# EAGLE design Motherboard Rev C (EAGLE 9.2.1)
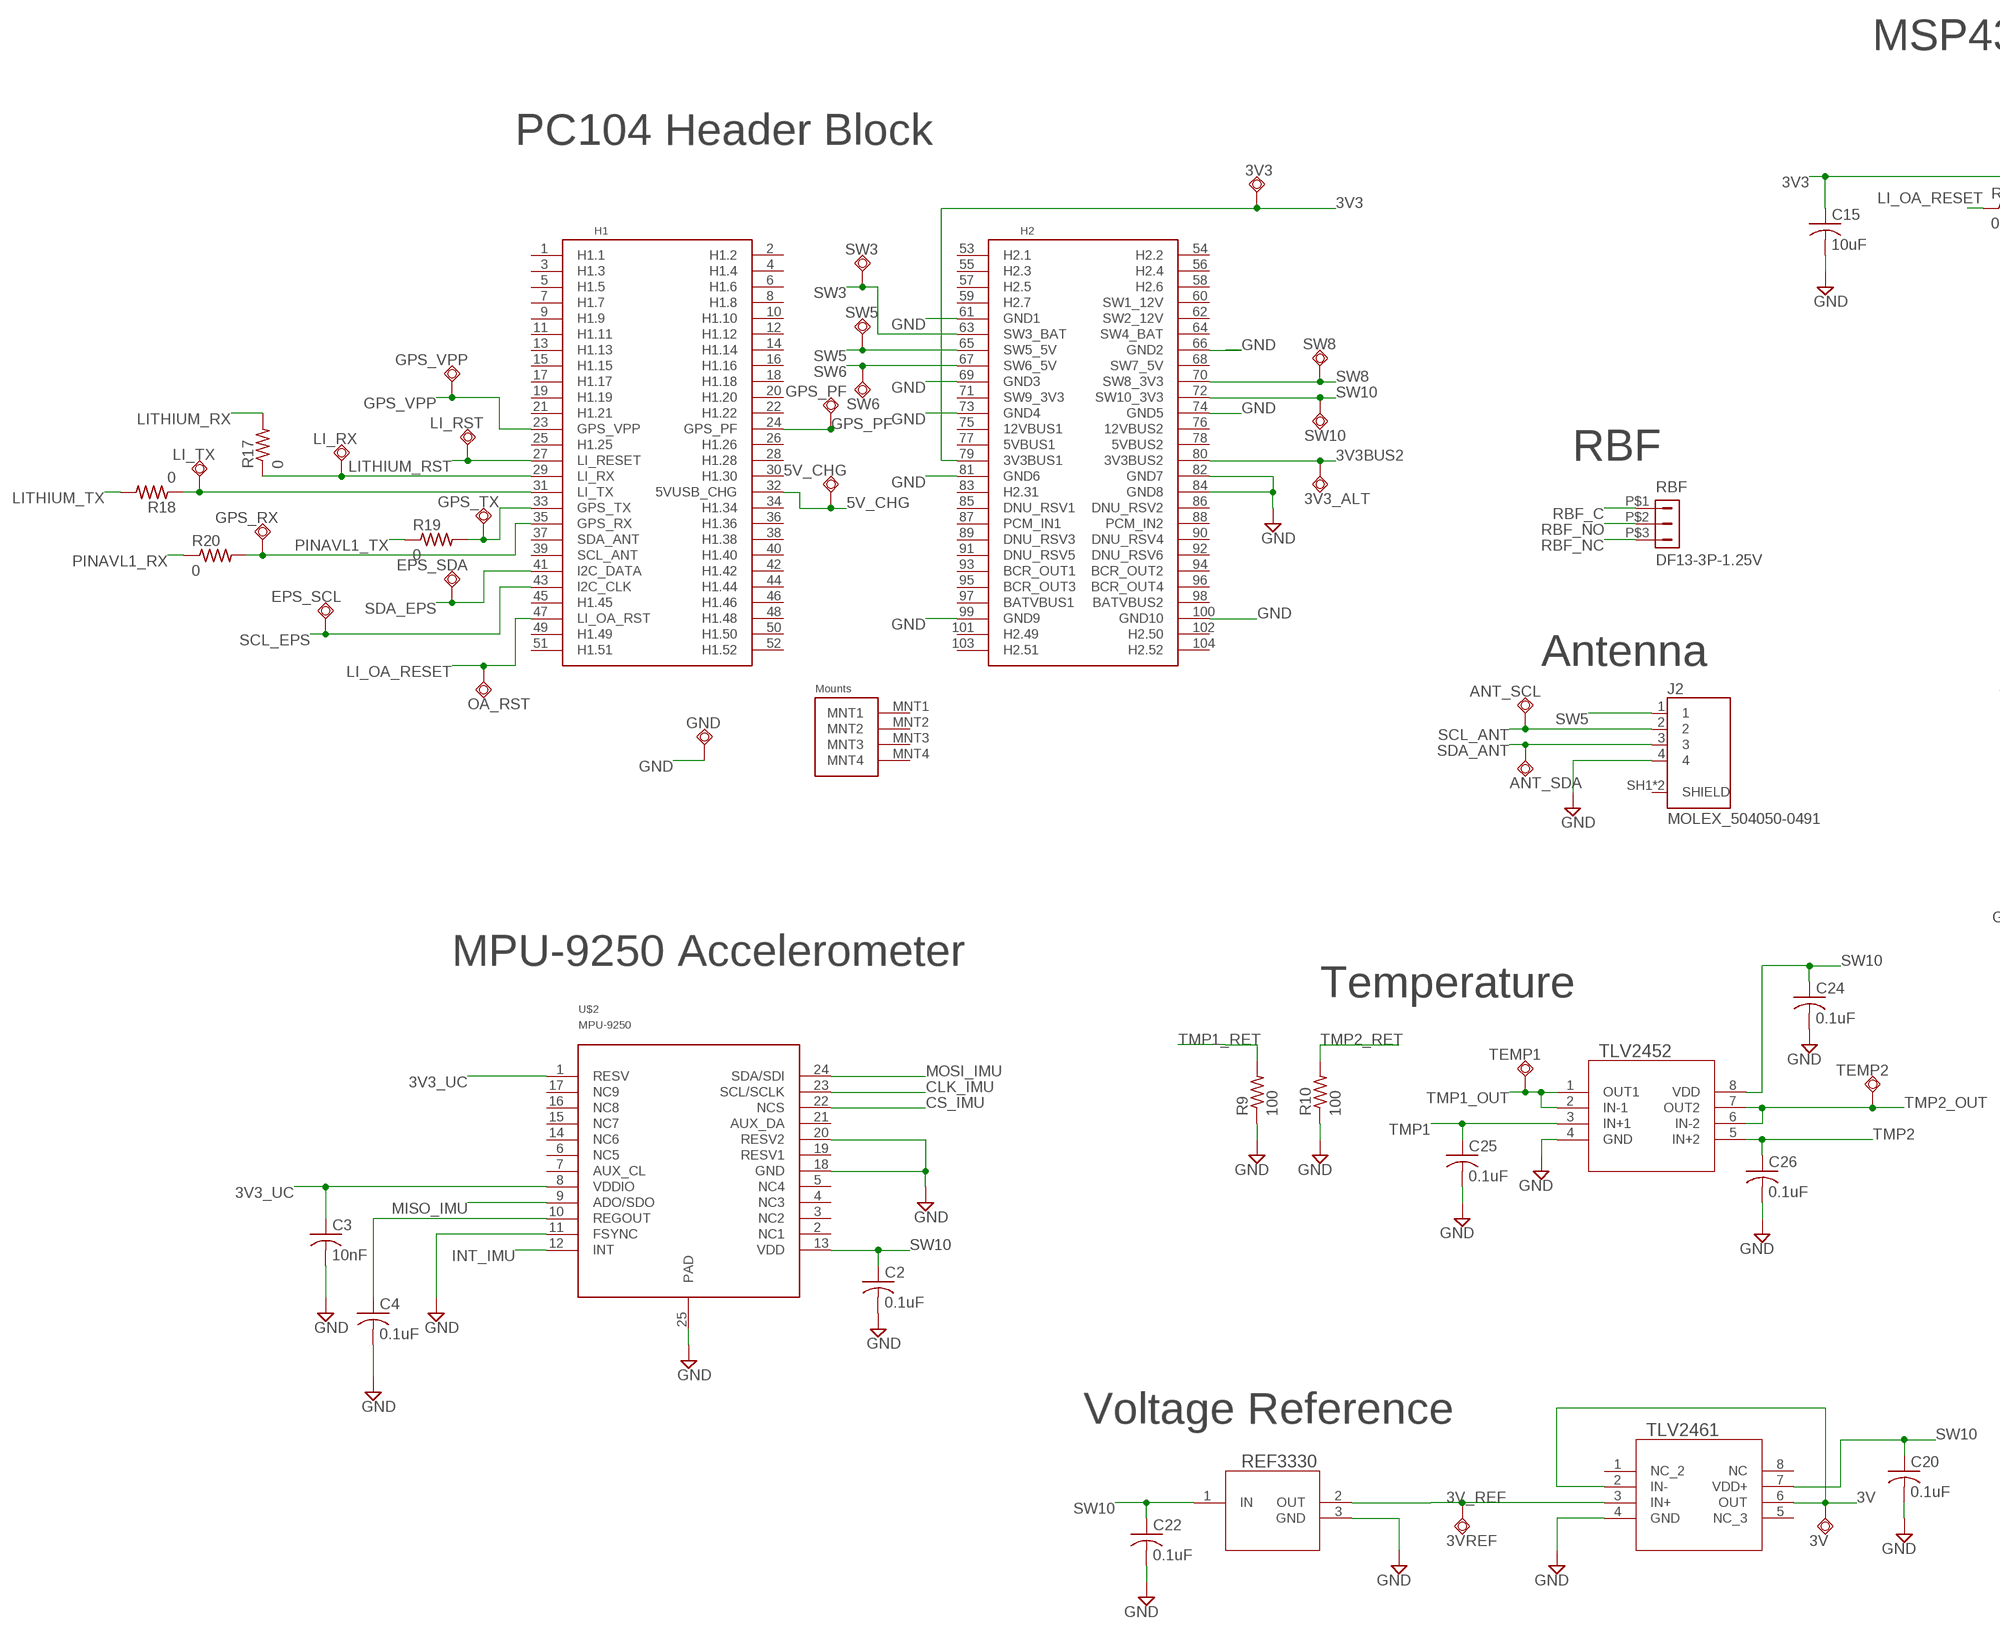
[diagram p0: schematic, sheet 1, part 1 of 2]
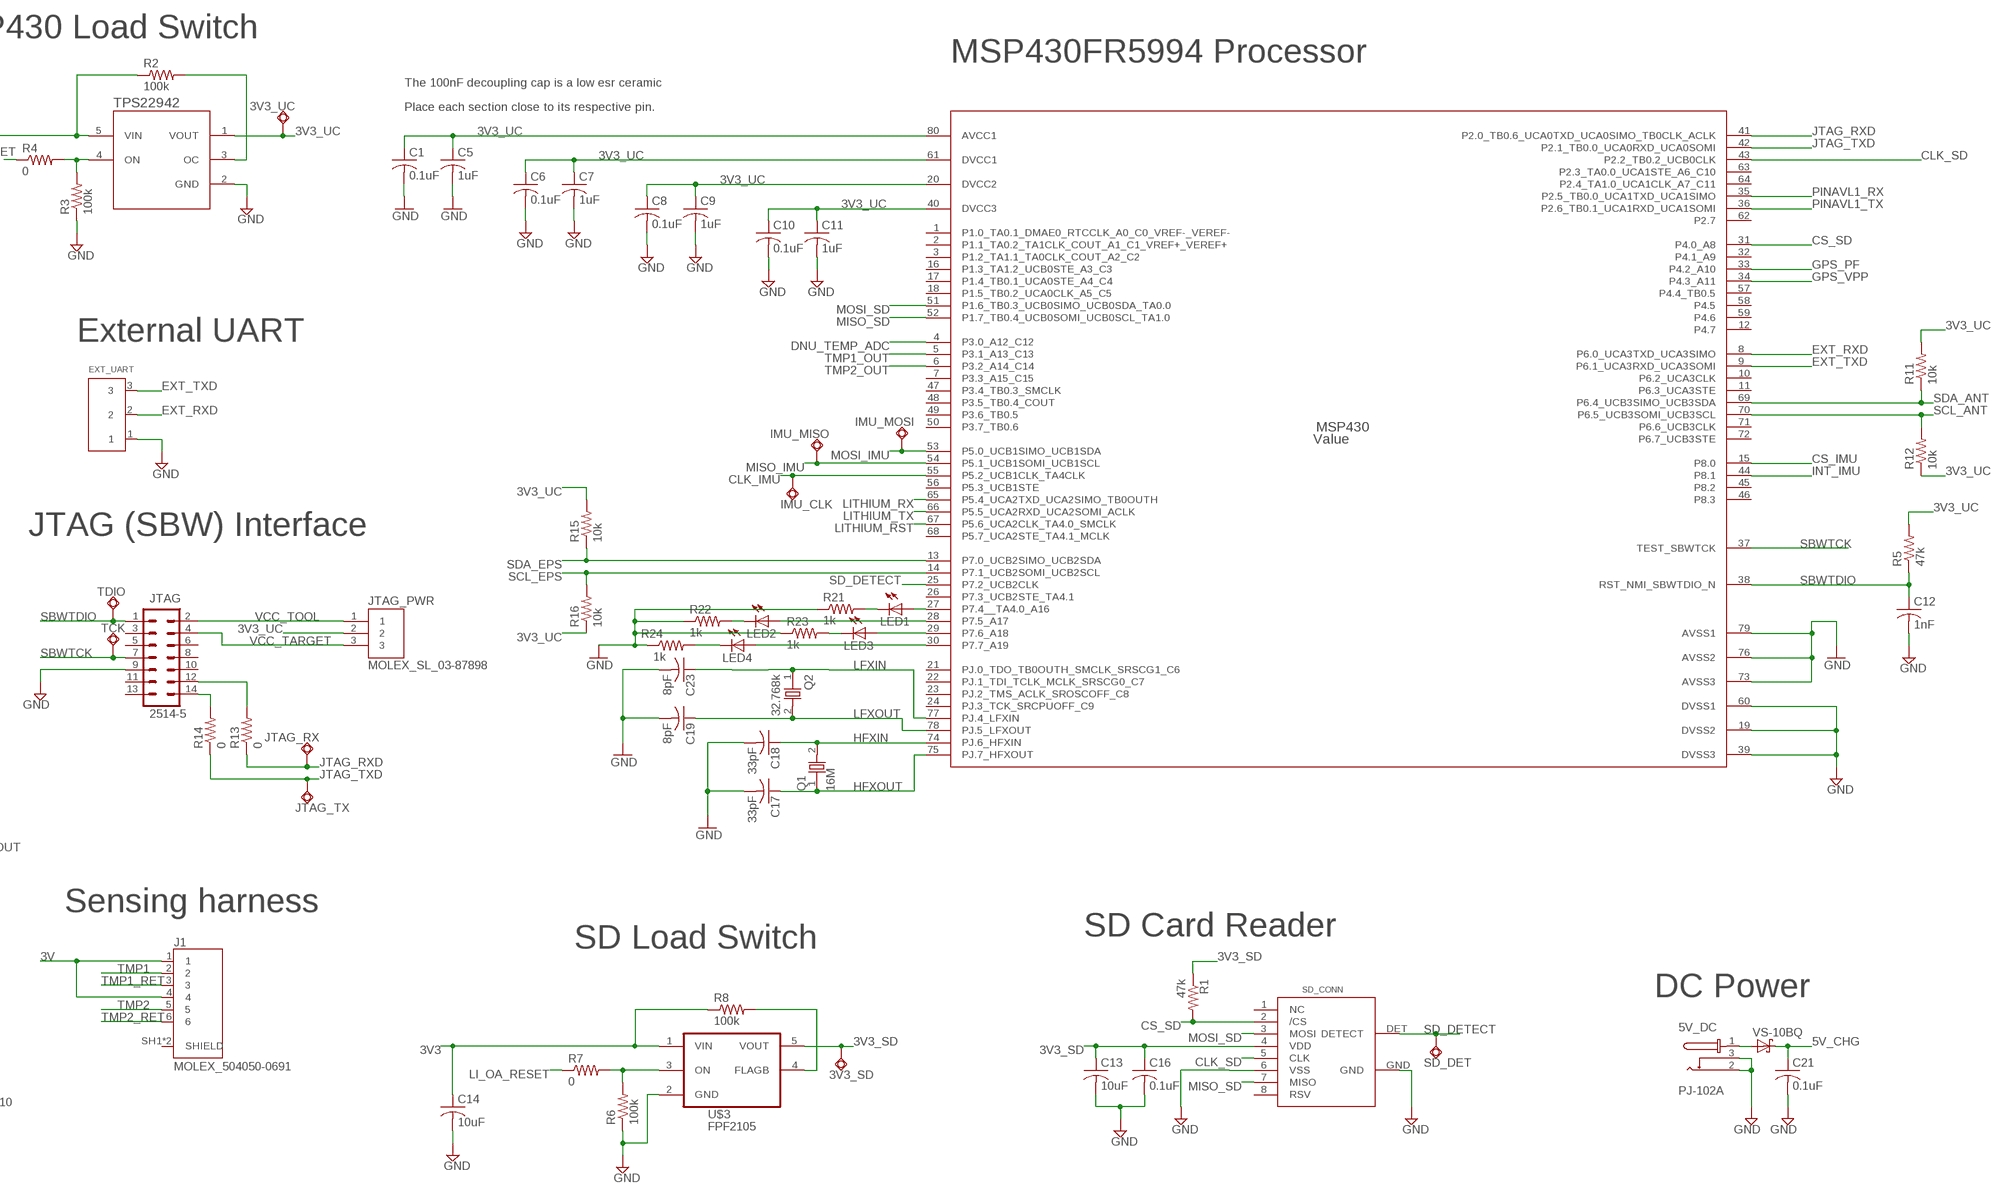
[diagram p1: schematic, sheet 1, part 2 of 2]

## Parts
3V  TPSQTP10SQ  [TP10SQ]
3V3  TPSQTP10SQ  [TP10SQ]
3V3_ALT  TPSQTP10SQ  [TP10SQ]
3V3_SD  TPSQTP10SQ  [TP10SQ]
3V3_UC  TPSQTP10SQ  [TP10SQ]
3VREF  TPSQTP10SQ  [TP10SQ]
5V_CHG  TPSQTP10SQ  [TP10SQ]
5V_DC  PJ-102A  [CUI_PJ-102A]
ANT_SCL  TPSQTP10SQ  [TP10SQ]
ANT_SDA  TPSQTP10SQ  [TP10SQ]
C1  0.1uF  C-USC0805  [C0805]
C2  0.1uF  C-USC0805  [C0805]
C3  10nF  C-USC0805  [C0805]
C4  0.1uF  C-USC0805  [C0805]
C5  1uF  C-USC0805  [C0805]
C6  0.1uF  C-USC0805  [C0805]
C7  1uF  C-USC0805  [C0805]
C8  0.1uF  C-USC0805  [C0805]
C9  1uF  C-USC0805  [C0805]
C10  0.1uF  C-USC0805  [C0805]
C11  1uF  C-USC0805  [C0805]
C12  1nF  C-USC0805  [C0805]
C13  10uF  C-USC0805  [C0805]
C14  10uF  C-USC0805  [C0805]
C15  10uF  C-USC0805  [C0805]
C16  0.1uF  C-USC0805  [C0805]
C17  33pF  C-USC0805  [C0805]
C18  33pF  C-USC0805  [C0805]
C19  8pF  C-USC0805  [C0805]
C20  0.1uF  C-USC0805  [C0805]
C21  0.1uF  C-USC0805  [C0805]
C22  0.1uF  C-USC0805  [C0805]
C23  8pF  C-USC0805  [C0805]
C24  0.1uF  C-USC0805  [C0805]
C25  0.1uF  C-USC0805  [C0805]
C26  0.1uF  C-USC0805  [C0805]
EPS_SCL  TPSQTP10SQ  [TP10SQ]
EPS_SDA  TPSQTP10SQ  [TP10SQ]
EXT_UART  90121-0763  [90121-0763]
GND  TPSQTP10SQ  [TP10SQ]
GPS_PF  TPSQTP10SQ  [TP10SQ]
GPS_RX  TPSQTP10SQ  [TP10SQ]
GPS_TX  TPSQTP10SQ  [TP10SQ]
GPS_VPP  TPSQTP10SQ  [TP10SQ]
IMU_CLK  TPSQTP06SQ  [TP06SQ]
IMU_MISO  TPSQTP06SQ  [TP06SQ]
IMU_MOSI  TPSQTP06SQ  [TP06SQ]
J1  MOLEX_504050-0691  [MOLEX_5040500691]
J2  MOLEX_504050-0491  [MOLEX_5040500491]
JTAG  2514-5  [PAK100/2500-5-14]
JTAG_PWR  MOLEX_SL_03-87898  [SL_87898_3]
JTAG_RX  TPSQTP10SQ  [TP10SQ]
JTAG_TX  TPSQTP10SQ  [TP10SQ]
LED1  LEDSML0805  [SML0805]
LED2  LEDSML0805  [SML0805]
LED3  LEDSML0805  [SML0805]
LED4  LEDSML0805  [SML0805]
LI_RST  TPSQTP10SQ  [TP10SQ]
LI_RX  TPSQTP10SQ  [TP10SQ]
LI_TX  TPSQTP10SQ  [TP10SQ]
MSP430  Value  MSP430FR5994IPNR  [PN0080A_N]
OA_RST  TPSQTP10SQ  [TP10SQ]
Q1  16M  FOX-C5BQ  [5X3.2]
Q2  32.768k  MS1V-T1K  [MS1V-T1K]
R1  47k  R-US_R0805  [R0805]
R2  100k  R-US_R0805  [R0805]
R3  100k  R-US_R0805  [R0805]
R4  0  R-US_R0805  [R0805]
R5  47k  R-US_R0805  [R0805]
R6  100k  R-US_R0805  [R0805]
R7  0  R-US_R0805  [R0805]
R8  100k  R-US_R0805  [R0805]
R9  100  R-US_R0805  [R0805]
R10  100  R-US_R0805  [R0805]
R11  10k  R-US_R0805  [R0805]
R12  10k  R-US_R0805  [R0805]
R13  0  R-US_R0805  [R0805]
R14  0  R-US_R0805  [R0805]
R15  10k  R-US_R0805  [R0805]
R16  10k  R-US_R0805  [R0805]
R17  0  R-US_R0805  [R0805]
R18  0  R-US_R0805  [R0805]
R19  0  R-US_R0805  [R0805]
R20  0  R-US_R0805  [R0805]
R21  1k  R-US_R0805  [R0805]
R22  1k  R-US_R0805  [R0805]
R23  1k  R-US_R0805  [R0805]
R24  1k  R-US_R0805  [R0805]
RBF  DF13-3P-1.25V  [DF13C-3P-1.25V]
REF3330  REF3330_DBZ_3  [DBZ3]
SD_CONN  502702-0891  [502702]
SD_DET  TPSQTP10SQ  [TP10SQ]
SW3  TPSQTP10SQ  [TP10SQ]
SW5  TPSQTP10SQ  [TP10SQ]
SW6  TPSQTP10SQ  [TP10SQ]
SW8  TPSQTP10SQ  [TP10SQ]
SW10  TPSQTP10SQ  [TP10SQ]
TCK  TPSQTP10SQ  [TP10SQ]
TDIO  TPSQTP10SQ  [TP10SQ]
TEMP1  TPSQTP10SQ  [TP10SQ]
TEMP2  TPSQTP10SQ  [TP10SQ]
TLV2452  TLV2452  [D8]
TLV2461  TLV2461A_D_8  [D8]
TPS22942  TPS22942DCKR  [DCK0005A]
U$1  PC104_NO_DIMENSION  [PC104_NO_DIMENSION]
U$2  MPU-9250  [LEAD-QFN24]
U$3  FPF2105  [SOT23-5]
VS-10BQ  10BQ015HM3  [SMB]

## Nets
3V: 3V.TP J1.1 J1.4 TLV2461.2(IN-) TLV2461.6(OUT)
3V3: 3V3.TP C14.1 C15.1 R2.1 R8.1 TPS22942.5(VIN) U$1.79(3V3BUS1) U$3.1(VIN)
3V3_SD: 3V3_SD.TP C13.1 C16.1 R1.1 SD_CONN.4(VDD) U$3.5(VOUT)
3V3_UC: 3V3_UC.TP C1.1 C3.1 C5.1 C6.1 C7.1 C8.1 C9.1 C10.1 C11.1 JTAG_PWR.2 MSP430.20(DVCC2) MSP430.40(DVCC3) MSP430.61(DVCC1) MSP430.80(AVCC1) R5.2 R11.2 R12.1 R15.2 R16.1 TPS22942.1(VOUT) U$2.1(RESV) U$2.8(VDDIO)
3V3BUS2: 3V3_ALT.TP U$1.80(3V3BUS2)
3V_REF: 3VREF.TP REF3330.2(OUT) TLV2461.3(IN+)
5V_CHG: 5V_CHG.TP C21.1 U$1.32(5VUSB_CHG) VS-10BQ.C
CLK_IMU: IMU_CLK.TP MSP430.55(P5.2_UCB1CLK_TA4CLK) U$2.23(SCL/SCLK)
CLK_SD: MSP430.43(P2.2_TB0.2_UCB0CLK) SD_CONN.5(CLK)
CS_IMU: MSP430.15(P8.0) U$2.22(NCS)
CS_SD: MSP430.31(P4.0_A8) R1.2 SD_CONN.2(/CS)
DNU_TEMP_ADC: MSP430.4(P3.0_A12_C12)
EXT_RXD: EXT_UART.2 MSP430.8(P6.0_UCA3TXD_UCA3SIMO)
EXT_TXD: EXT_UART.3 MSP430.9(P6.1_UCA3RXD_UCA3SOMI)
GND: 5V_DC.2 5V_DC.3 C1.2 C2.2 C3.2 C4.2 C5.2 C6.2 C7.2 C8.2 C9.2 C10.2 C11.2 C12.2 C13.2 C14.2 C15.2 C16.2 C17.2 C18.2 C19.2 C20.2 C21.2 C22.2 C23.2 C24.2 C25.2 C26.2 EXT_UART.1 GND.TP J2.4 JTAG.9 MSP430.19(DVSS2) MSP430.39(DVSS3) MSP430.60(DVSS1) MSP430.73(AVSS3) MSP430.76(AVSS2) MSP430.79(AVSS1) R3.1 R6.1 R9.1 R10.1 R21.1 R22.1 R23.1 R24.1 REF3330.3(GND) SD_CONN.6(VSS) SD_CONN.GND TLV2452.4(GND) TLV2461.4(GND) TPS22942.2(GND) U$1.61(GND1) U$1.66(GND2) U$1.69(GND3) U$1.73(GND4) U$1.74(GND5) U$1.81(GND6) U$1.82(GND7) U$1.84(GND8) U$1.99(GND9) U$1.100(GND10) U$2.11(FSYNC) U$2.18(GND) U$2.20(RESV2) U$2.25(PAD) U$3.2(GND)
GPS_PF: GPS_PF.TP MSP430.33(P4.2_A10) U$1.24(GPS_PF)
GPS_VPP: GPS_VPP.TP MSP430.34(P4.3_A11) U$1.23(GPS_VPP)
HFXIN: C18.1 MSP430.74(PJ.6_HFXIN) Q1.2
HFXOUT: C17.1 MSP430.75(PJ.7_HFXOUT) Q1.1
INT_IMU: MSP430.44(P8.1) U$2.12(INT)
JTAG_RXD: JTAG_RX.TP MSP430.41(P2.0_TB0.6_UCA0TXD_UCA0SIMO_TB0CLK_ACLK) R13.1
JTAG_TXD: JTAG_TX.TP MSP430.42(P2.1_TB0.0_UCA0RXD_UCA0SOMI) R14.1
LFXIN: C23.1 MSP430.77(PJ.4_LFXIN) Q2.1
LFXOUT: C19.1 MSP430.78(PJ.5_LFXOUT) Q2.2
LI_OA_RESET: OA_RST.TP R4.1 R7.1 U$1.47(LI_OA_RST)
LITHIUM_RST: LI_RST.TP MSP430.67(P5.6_UCA2CLK_TA4.0_SMCLK) U$1.27(LI_RESET)
LITHIUM_RX: MSP430.65(P5.4_UCA2TXD_UCA2SIMO_TB0OUTH) R17.2
LITHIUM_TX: MSP430.66(P5.5_UCA2RXD_UCA2SOMI_ACLK) R18.2
MISO_IMU: IMU_MISO.TP MSP430.54(P5.1_UCB1SOMI_UCB1SCL) U$2.9(ADO/SDO)
MISO_SD: MSP430.52(P1.7_TB0.4_UCB0SOMI_UCB0SCL_TA1.0) SD_CONN.7(MISO)
MOSI_IMU: IMU_MOSI.TP MSP430.53(P5.0_UCB1SIMO_UCB1SDA) U$2.24(SDA/SDI)
MOSI_SD: MSP430.51(P1.6_TB0.3_UCB0SIMO_UCB0SDA_TA0.0) SD_CONN.3(MOSI)
N$1: R2.2 TPS22942.3(OC)
N$2: R6.2 R7.2 U$3.3(ON)
N$3: C4.1 U$2.10(REGOUT)
N$4: LED1.C R21.2
N$5: R3.2 R4.2 TPS22942.4(ON)
N$6: LED1.A MSP430.27(P7.4__TA4.0_A16)
N$7: R8.2 U$3.4(FLAGB)
N$8: JTAG.14 R14.2
N$9: LED2.A MSP430.28(P7.5_A17)
N$10: LED2.C R22.2
N$11: JTAG.12 R13.2
N$12: LED3.A MSP430.29(P7.6_A18)
N$14: 5V_DC.1 VS-10BQ.A
N$15: LED3.C R23.2
N$16: LED4.A MSP430.30(P7.7_A19)
N$17: LED4.C R24.2
N$96: GPS_RX.TP R20.2 U$1.35(GPS_RX)
N$97: GPS_TX.TP R19.2 U$1.33(GPS_TX)
N$98: LI_TX.TP R18.1 U$1.31(LI_TX)
N$99: LI_RX.TP R17.1 U$1.29(LI_RX)
PINAVL1_RX: MSP430.35(P2.5_TB0.0_UCA1TXD_UCA1SIMO) R20.1
PINAVL1_TX: MSP430.36(P2.6_TB0.1_UCA1RXD_UCA1SOMI) R19.1
RBF_C: RBF.P$1
RBF_NC: RBF.P$3
RBF_NO: RBF.P$2
SBWTCK: JTAG.7 MSP430.37(TEST_SBWTCK) TCK.TP
SBWTDIO: C12.1 JTAG.1 MSP430.38(RST_NMI_SBWTDIO_N) R5.1 TDIO.TP
SCL_ANT: ANT_SCL.TP J2.2 MSP430.70(P6.5_UCB3SOMI_UCB3SCL) R12.2
SCL_EPS: EPS_SCL.TP MSP430.14(P7.1_UCB2SOMI_UCB2SCL) R16.2 U$1.43(I2C_CLK)
SD_DETECT: MSP430.25(P7.2_UCB2CLK) SD_CONN.DET(DETECT) SD_DET.TP
SDA_ANT: ANT_SDA.TP J2.3 MSP430.69(P6.4_UCB3SIMO_UCB3SDA) R11.1
SDA_EPS: EPS_SDA.TP MSP430.13(P7.0_UCB2SIMO_UCB2SDA) R15.1 U$1.41(I2C_DATA)
SW3: SW3.TP U$1.63(SW3_BAT)
SW5: J2.1 SW5.TP U$1.65(SW5_5V)
SW6: SW6.TP U$1.67(SW6_5V)
SW8: SW8.TP U$1.70(SW8_3V3)
SW10: C2.1 C20.1 C22.1 C24.1 REF3330.1(IN) SW10.TP TLV2452.8(VDD) TLV2461.7(VDD+) U$1.72(SW10_3V3) U$2.13(VDD)
TMP1: C25.1 J1.2 TLV2452.3(IN+1)
TMP1_OUT: MSP430.5(P3.1_A13_C13) TEMP1.TP TLV2452.1(OUT1) TLV2452.2(IN-1)
TMP1_RET: J1.3 R9.2
TMP2: C26.1 J1.5 TLV2452.5(IN+2)
TMP2_OUT: MSP430.6(P3.2_A14_C14) TEMP2.TP TLV2452.6(IN-2) TLV2452.7(OUT2)
TMP2_RET: J1.6 R10.2
VCC_TARGET: JTAG.4 JTAG_PWR.3
VCC_TOOL: JTAG.2 JTAG_PWR.1
Unconnected: JTAG.3 JTAG.5 JTAG.6 JTAG.8 JTAG.10 JTAG.11 JTAG.13 MSP430.1(P1.0_TA0.1_DMAE0_RTCCLK_A0_C0_VREF-_VEREF-) MSP430.2(P1.1_TA0.2_TA1CLK_COUT_A1_C1_VREF+_VEREF+) MSP430.3(P1.2_TA1.1_TA0CLK_COUT_A2_C2) MSP430.7(P3.3_A15_C15) MSP430.10(P6.2_UCA3CLK) MSP430.11(P6.3_UCA3STE) MSP430.12(P4.7) MSP430.16(P1.3_TA1.2_UCB0STE_A3_C3) MSP430.17(P1.4_TB0.1_UCA0STE_A4_C4) MSP430.18(P1.5_TB0.2_UCA0CLK_A5_C5) MSP430.21(PJ.0_TDO_TB0OUTH_SMCLK_SRSCG1_C6) MSP430.22(PJ.1_TDI_TCLK_MCLK_SRSCG0_C7) MSP430.23(PJ.2_TMS_ACLK_SROSCOFF_C8) MSP430.24(PJ.3_TCK_SRCPUOFF_C9) MSP430.26(P7.3_UCB2STE_TA4.1) MSP430.32(P4.1_A9) MSP430.45(P8.2) MSP430.46(P8.3) MSP430.47(P3.4_TB0.3_SMCLK) MSP430.48(P3.5_TB0.4_COUT) MSP430.49(P3.6_TB0.5) MSP430.50(P3.7_TB0.6) MSP430.56(P5.3_UCB1STE) MSP430.57(P4.4_TB0.5) MSP430.58(P4.5) MSP430.59(P4.6) MSP430.62(P2.7) MSP430.63(P2.3_TA0.0_UCA1STE_A6_C10) MSP430.64(P2.4_TA1.0_UCA1CLK_A7_C11) MSP430.68(P5.7_UCA2STE_TA4.1_MCLK) MSP430.71(P6.6_UCB3CLK) MSP430.72(P6.7_UCB3STE) SD_CONN.1(NC) SD_CONN.8(RSV) TLV2461.1(NC_2) TLV2461.5(NC_3) TLV2461.8(NC) U$1.1(H1.1) U$1.2(H1.2) U$1.3(H1.3) U$1.4(H1.4) U$1.5(H1.5) U$1.6(H1.6) U$1.7(H1.7) U$1.8(H1.8) U$1.9(H1.9) U$1.10(H1.10) U$1.11(H1.11) U$1.12(H1.12) U$1.13(H1.13) U$1.14(H1.14) U$1.15(H1.15) U$1.16(H1.16) U$1.17(H1.17) U$1.18(H1.18) U$1.19(H1.19) U$1.20(H1.20) U$1.21(H1.21) U$1.22(H1.22) U$1.25(H1.25) U$1.26(H1.26) U$1.28(H1.28) U$1.30(H1.30) U$1.34(H1.34) U$1.36(H1.36) U$1.37(SDA_ANT) U$1.38(H1.38) U$1.39(SCL_ANT) U$1.40(H1.40) U$1.42(H1.42) U$1.44(H1.44) U$1.45(H1.45) U$1.46(H1.46) U$1.48(H1.48) U$1.49(H1.49) U$1.50(H1.50) U$1.51(H1.51) U$1.52(H1.52) U$1.53(H2.1) U$1.54(H2.2) U$1.55(H2.3) U$1.56(H2.4) U$1.57(H2.5) U$1.58(H2.6) U$1.59(H2.7) U$1.60(SW1_12V) U$1.62(SW2_12V) U$1.64(SW4_BAT) U$1.68(SW7_5V) U$1.71(SW9_3V3) U$1.75(12VBUS1) U$1.76(12VBUS2) U$1.77(5VBUS1) U$1.78(5VBUS2) U$1.83(H2.31) U$1.85(DNU_RSV1) U$1.86(DNU_RSV2) U$1.87(PCM_IN1) U$1.88(PCM_IN2) U$1.89(DNU_RSV3) U$1.90(DNU_RSV4) U$1.91(DNU_RSV5) U$1.92(DNU_RSV6) U$1.93(BCR_OUT1) U$1.94(BCR_OUT2) U$1.95(BCR_OUT3) U$1.96(BCR_OUT4) U$1.97(BATVBUS1) U$1.98(BATVBUS2) U$1.101(H2.49) U$1.102(H2.50) U$1.103(H2.51) U$1.104(H2.52) U$1.MNT1 U$1.MNT2 U$1.MNT3 U$1.MNT4 U$2.2(NC1) U$2.3(NC2) U$2.4(NC3) U$2.5(NC4) U$2.6(NC5) U$2.7(AUX_CL) U$2.14(NC6) U$2.15(NC7) U$2.16(NC8) U$2.17(NC9) U$2.19(RESV1) U$2.21(AUX_DA)

## Notes on the sheet
- MSP430 Load Switch
- MSP430FR5994 Processor
- The 100nF decoupling cap is a low esr ceramic
- PC104 Header Block | Place each section close to its respective pin.
- External UART
- RBF
- Antenna
- JTAG (SBW) Interface
- MPU-9250 Accelerometer
- Temperature
- Sensing harness
- SD Card Reader
- SD Load Switch
- DC Power
- Voltage Reference

## Power pins joined to a net without a drawn wire
SHIELD: J1.SH1(SHIELD) J1.SH2(SHIELD) J2.SH1(SHIELD) J2.SH2(SHIELD)

## Library data of the parts
3V 3V3 3V3_ALT 3V3_SD 3V3_UC 3VREF 5V_CHG ANT_SCL ANT_SDA EPS_SCL EPS_SDA GND GPS_PF GPS_RX GPS_TX GPS_VPP IMU_CLK IMU_MISO IMU_MOSI JTAG_RX JTAG_TX LI_RST LI_RX LI_TX OA_RST SD_DET SW3 SW5 SW6 SW8 SW10 TCK TDIO TEMP1 TEMP2 = testpad:TPSQ: Test pad
5V_DC = PJ-102A:PJ-102A: 2.0 mm Center Pin, 2.5 A, Right Angle, Through Hole, Tapered Pins, Dc Power Jack Connector; AVAILABILITY: Good; DESCRIPTION: 2.0 mm Center Pin%2C 2.5 A%2C Right Angle%2C Through Hole%2C Tapered Pins%2C Dc Power Jack Connector; MANUFACTURER: CUI inc; MF: CUI; MP: PJ-102A; PACKAGE: None; PRICE: 0.44 USD
C1-C11 C14 C15 = adafruit:C-US: CAPACITOR, American symbol
C12 C13 C16-C26 = resistor:C-US: CAPACITOR, American symbol
EXT_UART = Molex 90121-0763:90121-0763: Molex 90121-0763 3-position 0.100" right-angle breakaway header
J1 = Molex 504050:MOLEX_504050-0691: Conn Wire to Board HDR 5 POS 1.5mm Solder RA SMD Pico-Lock; AVAILABILITY: Good; DESCRIPTION: Conn Wire to Board HDR 5 POS 1.5mm Solder RA SMD Pico-Lock; MF: Molex; MP: 5040500491; PACKAGE: None
J2 = Molex 504050-0491:MOLEX_504050-0491: Conn Wire to Board HDR 4 POS 1.5mm Solder RA SMD Pico-Lock; AVAILABILITY: Good; DESCRIPTION: Conn Wire to Board HDR 4 POS 1.5mm Solder RA SMD Pico-Lock; MF: Molex; MP: 5040500491; PACKAGE: None
JTAG = con-3m:2514-: 3M (TM) Pak 100 4-Wall Header 3M (TM) .100" x .100" 4-Wall Header, Low Profile, D2500 Series -5: Right angle, through hole -6: Straight (vertical), through hole -6V: Straight (vertical), surface mount Source: 3M
JTAG_PWR = molex-sl-connectors_jw:MOLEX_SL_03: Molex SL-Series PCB Header, 3-Pos, 0.1" (2.54mm) Centers
LED1-LED4 = led:LED: LED OSRAM: - CHIPLED LG R971, LG N971, LY N971, LG Q971, LY Q971, LO R971, LY R971 LH N974, LH R974 LS Q976, LO Q976, LY Q976 LO Q996 - Hyper CHIPLED LW Q18S LB Q993, LB Q99A, LB R99A - SideLED LS A670, LO A670, LY A670, LG A670, LP A670 LB A673, LV A673, LT A673, LW A673 LH A674 LY A675 LS A676, LA A676, LO A676, LY A676, LW A676 LS A679, LY A679, LG A679 - Hyper Micro SIDELED® LS Y876, LA Y876, LO Y876, LY Y876 LT Y87S - SmartLED LW L88C, LW L88S LB L89C, LB L89S, LG L890 LS L89K, LO L89K, LY L89K LS L896, LA L896, LO L896, LY L896 - TOPLED LS T670, LO T670, LY T670, LG T670, LP T670 LSG T670, LSP T670, LSY T670, LOP T670, LYG T670 LG T671, LOG T671, LSG T671 LB T673, LV T673, LT T673, LW T673 LH T674 LS T676, LA T676, LO T676, LY T676, LB T676, LH T676, LSB T676, LW T676 LB T67C, LV T67C, LT T67C, LS T67K, LO T67K, LY T67K, LW E67C LS E67B, LA E67B, LO E67B, LY E67B, LB E67C, LV E67C, LT E67C LW T67C LS T679, LY T679, LG T679 LS T770, LO T770, LY T770, LG T770, LP T770 LB T773, LV T773, LT T773, LW T773 LH T774 LS E675, LA E675, LY E675, LS T675 LS T776, LA T776, LO T776, LY T776, LB T776 LHGB T686 LT T68C, LB T68C - Hyper Mini TOPLED® LB M676 - Mini TOPLED Santana® LG M470 LS M47K, LO M47K, LY M47K Source: http://www.osram.convergy.de LUXEON: - LUMILED® LXK2-PW12-R00, LXK2-PW12-S00, LXK2-PW14-U00, LXK2-PW14-V00 LXK2-PM12-R00, LXK2-PM12-S00, LXK2-PM14-U00 LXK2-PE12-Q00, LXK2-PE12-R00, LXK2-PE12-S00, LXK2-PE14-T00, LXK2-PE14-U00 LXK2-PB12-K00, LXK2-PB12-L00, LXK2-PB12-M00, LXK2-PB14-N00, LXK2-PB14-P00, LXK2-PB14-Q00 LXK2-PR12-L00, LXK2-PR12-M00, LXK2-PR14-Q00, LXK2-PR14-R00 LXK2-PD12-Q00, LXK2-PD12-R00, LXK2-PD12-S00 LXK2-PH12-R00, LXK2-PH12-S00 LXK2-PL12-P00, LXK2-PL12-Q00, LXK2-PL12-R00 Source: www.luxeon.com KINGBRIGHT: KA-3528ASYC Source: www.kingbright.com
MSP430 = VT_Parts_Eagle:MSP430FR5994IPNR; MANUFACTURER: Texas Instruments; PARTNUMBER: MSP430FR5994IPNR; REFDES: RefDes; TYPE: TYPE
Q1 = C5BQ:FOX-C5BQ
Q2 = MS1V-T1K:MS1V-T1K: Micro Crystal - SMD Tuning Fork, 32k-100k
R1-R24 = resistor:R-US_: RESISTOR, American symbol
RBF = con-hirose-df13:DF13-3P-1.25: DF13-3P 1.25mm Pitch Miniature Crimping Connector.
REF3330 = REF3330:REF3330_DBZ_3; MANUFACTURER_PART_NUMBER: ref3330_dbz_3; VENDOR: Texas Instruments
SD_CONN = Molex SD - 502702:502702-0891
TLV2452 = TLV24xx:TLV2452; MANUFACTURER_PART_NUMBER: tlv2461a_d_8; VENDOR: Texas Instruments
TLV2461 = TLV24xx:TLV2461A_D_8; MANUFACTURER_PART_NUMBER: tlv2461a_d_8; VENDOR: Texas Instruments
TPS22942 = TPS22942:TPS22942DCKR: TI TPS229422 SC70 current-limited load switch
U$1 = Cubesat:PC104_NO_DIMENSION
U$2 = VT_Parts_Eagle:MPU-9250
U$3 = FPF2105:FPF2105: SOT-23-5 FPF2105 400mA load switch
VS-10BQ = Vishay 10BQ015HM3:10BQ015HM3

## Board
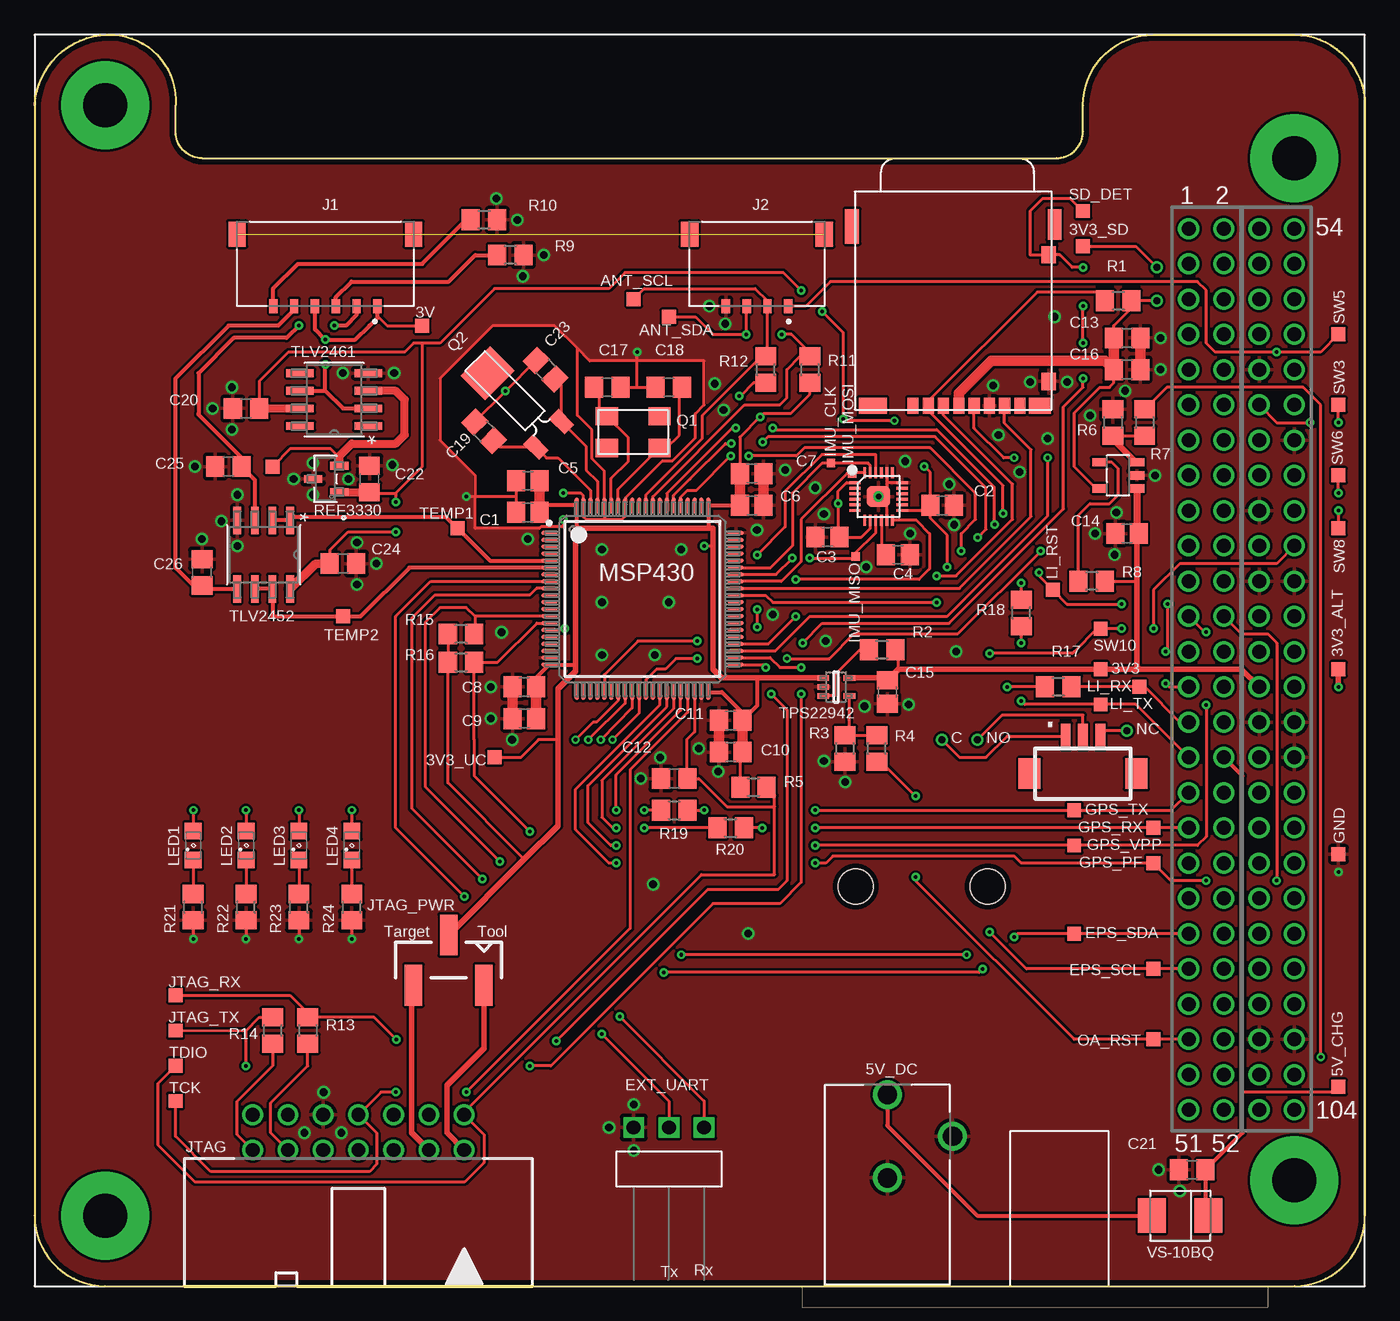
[diagram p2: board, top side]
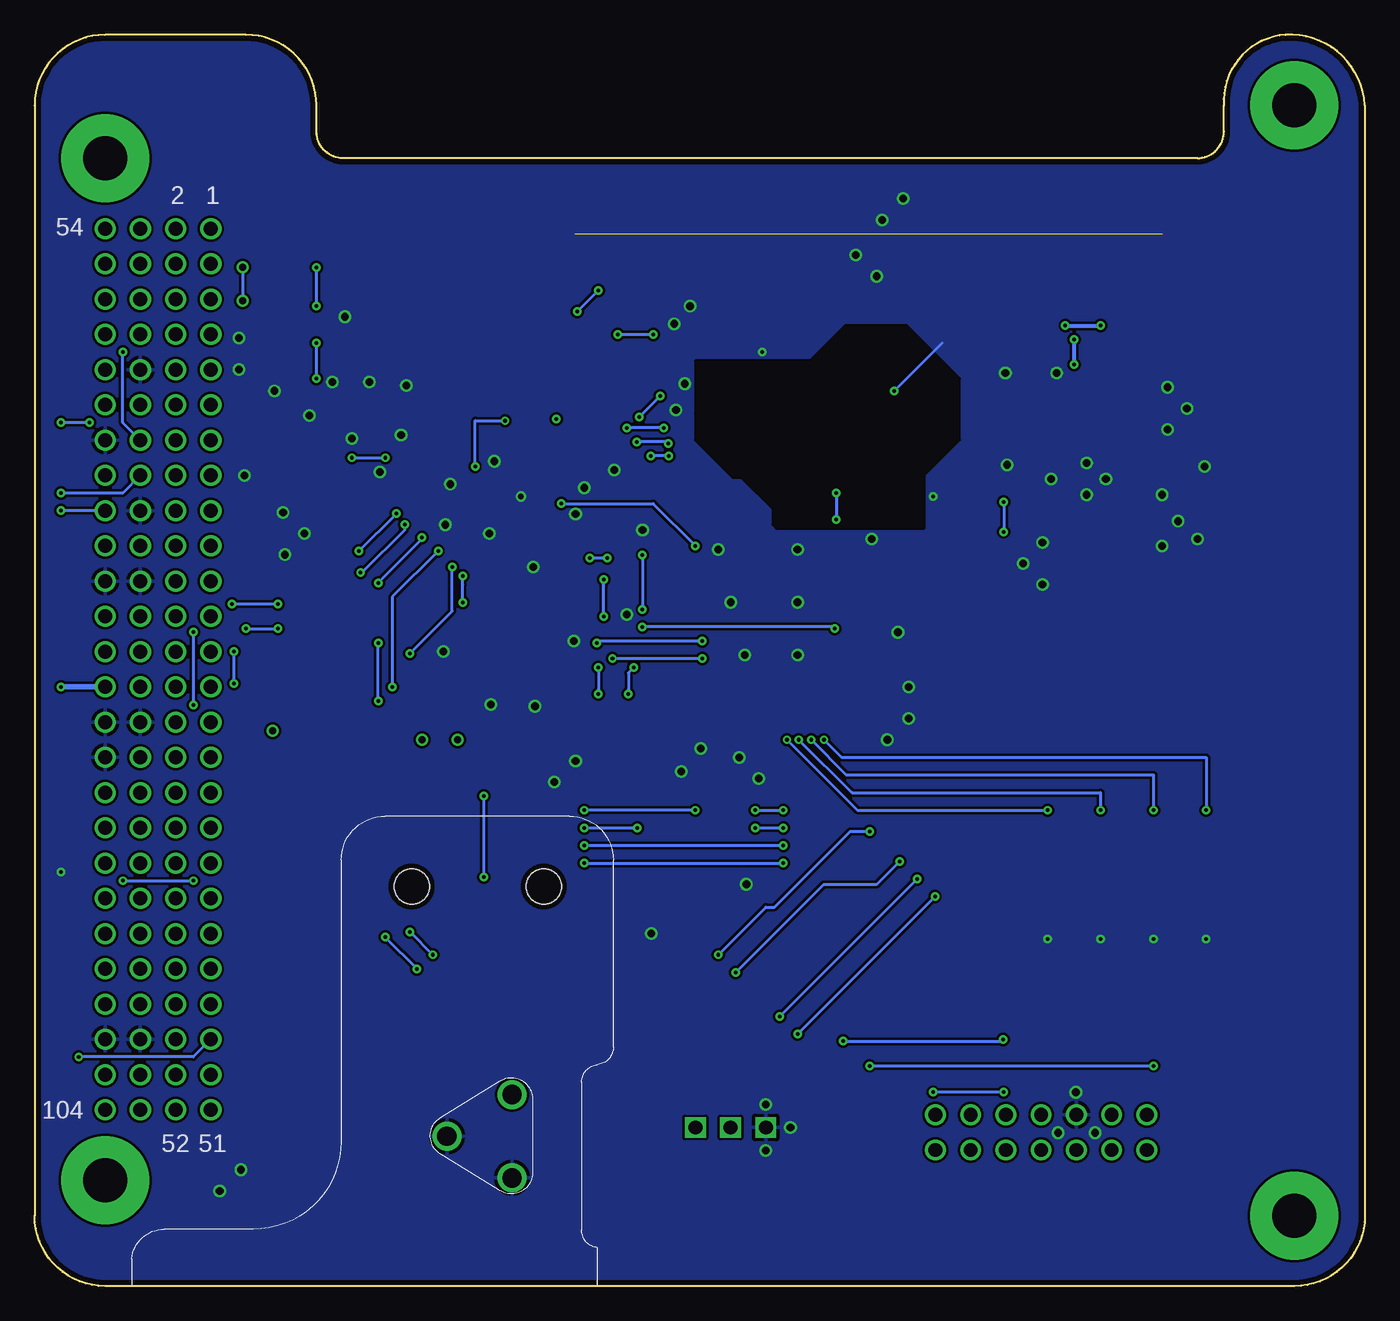
[diagram p3: board, bottom side, seen from below]

Size 95.89 x 90.18 mm. Coordinates in mm from the lower left corner, seen from the top.
Outline: 0,85.09 0,5.08 arc90 5.08,0 90.81,0 arc90 95.89,5.08 95.89,85.09 arc90 90.81,90.17 80.64,90.17 arc90 75.56,85.09 75.56,83.19 arc-90 73.66,81.28 12.06,81.28 arc-90 10.16,83.19 10.16,85.09 arc90 5.71,90.17 arc90 0,85.09
Copper layers (1*16): Top 0.035559375mm / dielectric 1.501140625mm / Bottom 0.035559375mm
Design rules "typical_4pcb *": minimum track width 7mil, minimum drill 5mil, track to track 7mil, track to pad 7mil, pad to pad 7mil, via to via 7mil, smd to smd 7mil, copper to edge 15mil, drill to drill 8mil, minimum pad ring 7mil, minimum via ring 7mil, stop-mask expansion 4mil, vias tented up to drill 0mil, thermal gap 10mil

### Footprints (pad centres in the part's own frame; a part is rotated, then mirrored left to right if it is on the bottom)
TP10SQ = smd 1 x 1: TP 0,0
CUI_PJ-102A = drill 1.397: 1 0,-3; 2 0,3; 3 -4.7,0
C0805 = smd 1.3 x 1.5: 1 -0.85,0; 2 0.85,0
C0805' = smd 1.3 x 1.5: 1 -0.95,0; 2 0.95,0
90121-0763 = drill 1 square: 1 0,0; 2 2.54,0; 3 5.08,0
TP06SQ = smd 0.6 x 0.6: TP 0,0
MOLEX_5040500691 = smd 0.6 x 1: 1 -3.75,3.04; 2 -2.25,3.04; 3 -0.75,3.04; 4 0.75,3.04; 5 2.25,3.04; 6 3.75,3.04 | smd 1.25 x 1.8: SH1 6.355,-2.15; SH2 -6.355,-2.15
MOLEX_5040500491 = smd 0.6 x 1: 1 -2.25,3.04; 2 -0.75,3.04; 3 0.75,3.04; 4 2.25,3.04 | smd 1.25 x 1.8: SH1 4.855,-2.15; SH2 -4.855,-2.15
PAK100/2500-5-14 = drill 1 pad 1.422: 1 -20.16,-12.345; 2 -20.16,-9.805; 3 -17.62,-12.345; 4 -17.62,-9.805; 5 -15.08,-12.345; 6 -15.08,-9.805; 7 -12.54,-12.345; 8 -12.54,-9.805; 9 -10,-12.345; 10 -10,-9.805; 11 -7.46,-12.345; 12 -7.46,-9.805; 13 -4.92,-12.345; 14 -4.92,-9.805
SL_87898_3 = smd 1.27 x 2.946: 1 -2.54,1.803; 2 0,-1.803; 3 2.54,1.803
SML0805 = smd 1.2 x 1.2: A 1.05,0; C -1.05,0
PN0080A_N = smd 1.15 x 0.3: 1 -6.725,4.75; 2 -6.725,4.25; 3 -6.725,3.75; 4 -6.725,3.25; 5 -6.725,2.75; 6 -6.725,2.25; 7 -6.725,1.75; 8 -6.725,1.25; 9 -6.725,0.75; 10 -6.725,0.25; 11 -6.725,-0.25; 12 -6.725,-0.75; 13 -6.725,-1.25; 14 -6.725,-1.75; 15 -6.725,-2.25; 16 -6.725,-2.75; 17 -6.725,-3.25; 18 -6.725,-3.75; 19 -6.725,-4.25; 20 -6.725,-4.75; 41 6.725,-4.75; 42 6.725,-4.25; 43 6.725,-3.75; 44 6.725,-3.25; 45 6.725,-2.75; 46 6.725,-2.25; 47 6.725,-1.75; 48 6.725,-1.25; 49 6.725,-0.75; 50 6.725,-0.25; 51 6.725,0.25; 52 6.725,0.75; 53 6.725,1.25; 54 6.725,1.75; 55 6.725,2.25; 56 6.725,2.75; 57 6.725,3.25; 58 6.725,3.75; 59 6.725,4.25; 60 6.725,4.75 | smd 0.3 x 1.15: 21 -4.75,-6.725; 22 -4.25,-6.725; 23 -3.75,-6.725; 24 -3.25,-6.725; 25 -2.75,-6.725; 26 -2.25,-6.725; 27 -1.75,-6.725; 28 -1.25,-6.725; 29 -0.75,-6.725; 30 -0.25,-6.725; 31 0.25,-6.725; 32 0.75,-6.725; 33 1.25,-6.725; 34 1.75,-6.725; 35 2.25,-6.725; 36 2.75,-6.725; 37 3.25,-6.725; 38 3.75,-6.725; 39 4.25,-6.725; 40 4.75,-6.725; 61 4.75,6.725; 62 4.25,6.725; 63 3.75,6.725; 64 3.25,6.725; 65 2.75,6.725; 66 2.25,6.725; 67 1.75,6.725; 68 1.25,6.725; 69 0.75,6.725; 70 0.25,6.725; 71 -0.25,6.725; 72 -0.75,6.725; 73 -1.25,6.725; 74 -1.75,6.725; 75 -2.25,6.725; 76 -2.75,6.725; 77 -3.25,6.725; 78 -3.75,6.725; 79 -4.25,6.725; 80 -4.75,6.725
5X3.2 = smd 1.6 x 1.3: 1 0.6,2.75; 2 4.4,0.45; NC1 0.6,0.45; NC2 4.4,2.75
MS1V-T1K = smd 1.6 x 1: 1 7.5,1.3; 2 7.5,-1.3 | smd 2.5 x 3: MNT 1.25,0
R0805 = smd 1.3 x 1.5: 1 -0.95,0; 2 0.95,0
DF13C-3P-1.25V = smd 1.6 x 2.2: M$0 3.85,-1.8; M$1 -3.85,-1.8 | smd 0.7 x 1.8: P$1 -1.25,0.9; P$2 0,0.9; P$3 1.25,0.9
DBZ3 = smd 0.559 x 1.321: 1 -0.95,-1.016; 2 0.95,-1.016; 3 0,0.883
502702 = smd 0.8 x 1.16: 1 4.9,0.58; 2 6,0.58; 3 7.1,0.58; 4 8.2,0.58; 5 9.3,0.58; 6 10.4,0.58; 7 11.5,0.58; 8 12.6,0.58 | smd 1.05 x 1.25: DET 14.685,11.45; GND 14.685,2.325 | smd 1 x 2.5: MNT1 0.5,13.5 | smd 2 x 1.16: MNT2 2,0.58 | smd 1.6 x 1.16: MNT3 14.04,0.58 | smd 1 x 2.2: MNT4 15.1,13.65
D8 = smd 1.981 x 0.559: 1 -2.464,1.905; 2 -2.464,0.635; 3 -2.464,-0.635; 4 -2.464,-1.905; 5 2.464,-1.905; 6 2.464,-0.635; 7 2.464,0.635; 8 2.464,1.905
DCK0005A = smd 0.85 x 0.4: 1 -0.95,0.65; 2 -0.95,0; 3 -0.95,-0.65; 4 0.95,-0.65; 5 0.95,0.65
PC104_NO_DIMENSION = drill 1.016 pad 1.524: 1 83.185,76.2; 2 85.725,76.2; 3 83.185,73.66; 4 85.725,73.66; 5 83.185,71.12; 6 85.725,71.12; 7 83.185,68.58; 8 85.725,68.58; 9 83.185,66.04; 10 85.725,66.04; 11 83.185,63.5; 12 85.725,63.5; 13 83.185,60.96; 14 85.725,60.96; 15 83.185,58.42; 16 85.725,58.42; 17 83.185,55.88; 18 85.725,55.88; 19 83.185,53.34; 20 85.725,53.34; 21 83.185,50.8; 22 85.725,50.8; 23 83.185,48.26; 24 85.725,48.26; 25 83.185,45.72; 26 85.725,45.72; 27 83.185,43.18; 28 85.725,43.18; 29 83.185,40.64; 30 85.725,40.64; 31 83.185,38.1; 32 85.725,38.1; 33 83.185,35.56; 34 85.725,35.56; 35 83.185,33.02; 36 85.725,33.02; 37 83.185,30.48; 38 85.725,30.48; 39 83.185,27.94; 40 85.725,27.94; 41 83.185,25.4; 42 85.725,25.4; 43 83.185,22.86; 44 85.725,22.86; 45 83.185,20.32; 46 85.725,20.32; 47 83.185,17.78; 48 85.725,17.78; 49 83.185,15.24; 50 85.725,15.24; 51 83.185,12.7; 52 85.725,12.7; 53 88.265,76.2; 54 90.805,76.2; 55 88.265,73.66; 56 90.805,73.66; 57 88.265,71.12; 58 90.805,71.12; 59 88.265,68.58; 60 90.805,68.58; 61 88.265,66.04; 62 90.805,66.04; 63 88.265,63.5; 64 90.805,63.5; 65 88.265,60.96; 66 90.805,60.96; 67 88.265,58.42; 68 90.805,58.42; 69 88.265,55.88; 70 90.805,55.88; 71 88.265,53.34; 72 90.805,53.34; 73 88.265,50.8; 74 90.805,50.8; 75 88.265,48.26; 76 90.805,48.26; 77 88.265,45.72; 78 90.805,45.72; 79 88.265,43.18; 80 90.805,43.18; 81 88.265,40.64; 82 90.805,40.64; 83 88.265,38.1; 84 90.805,38.1; 85 88.265,35.56; 86 90.805,35.56; 87 88.265,33.02; 88 90.805,33.02; 89 88.265,30.48; 90 90.805,30.48; 91 88.265,27.94; 92 90.805,27.94; 93 88.265,25.4; 94 90.805,25.4; 95 88.265,22.86; 96 90.805,22.86; 97 88.265,20.32; 98 90.805,20.32; 99 88.265,17.78; 100 90.805,17.78; 101 88.265,15.24; 102 90.805,15.24; 103 88.265,12.7; 104 90.805,12.7 | drill 3.175 pad 6.35: MNT1 5.08,85.09; MNT2 5.08,5.08; MNT3 90.805,81.28; MNT4 90.805,7.62
LEAD-QFN24 = smd 0.8 x 0.2: 1 -1.7,1; 2 -1.7,0.6; 3 -1.7,0.2; 4 -1.7,-0.2; 5 -1.7,-0.6; 6 -1.7,-1; 13 1.7,-1; 14 1.7,-0.6; 15 1.7,-0.2; 16 1.7,0.2; 17 1.7,0.6; 18 1.7,1 | smd 0.2 x 0.8: 7 -1,-1.7; 8 -0.6,-1.7; 9 -0.2,-1.7; 10 0.2,-1.7; 11 0.6,-1.7; 12 1,-1.7; 19 1,1.7; 20 0.6,1.7; 21 0.2,1.7; 22 -0.2,1.7; 23 -0.6,1.7; 24 -1,1.7 | smd 1.7 x 1.54: 25 0,0
SOT23-5 = smd 0.6 x 1.05: 1 -0.95,-1.35; 2 0,-1.35; 3 0.95,-1.35; 4 0.95,1.35; 5 -0.95,1.35
RBF_MOUNT = hole 2.54: 28.793,29.718; 28.793,20.193
SMB = smd 2.007 x 2.489: A -2.019,0; C 2.045,0

### Placement (x,y rotation side)
3V  27.94,69.22 0 top
3V3  76.83,44.45 0 top
3V3_ALT  93.98,44.45 90 top
3V3_SD  75.56,74.93 0 top
3V3_UC  33.15,38.1 0 top
3VREF  17.14,59.05 0 top
5V_CHG  93.98,14.35 90 top
5V_DC  61.47,10.79 180 top
ANT_SCL  43.18,71.12 0 top
ANT_SDA  45.72,69.85 0 top
C1  35.56,55.75 180 top
C2  65.41,56.26 0 top
C3  57.15,53.98 180 top
C4  62.23,52.7 0 top
C5  35.56,58.04 180 top
C6  51.69,56.26 0 top
C7  51.69,58.55 0 top
C8  35.31,43.18 180 top
C9  35.31,40.89 180 top
C10  50.16,38.48 180 top
C11  50.16,40.77 180 top
C12  1nF  [C0805']  46.1,36.58 180 top
C13  10uF  [C0805']  78.74,68.33 0 top
C14  78.74,54.23 180 top
C15  61.47,42.8 270 top
C16  0.1uF  [C0805']  78.74,66.04 0 top
C17  33pF  [C0805']  41.27,64.77 0 top
C18  33pF  [C0805']  45.72,64.77 180 top
C19  8pF  [C0805']  32.38,61.59 135 top
C20  0.1uF  [C0805']  15.24,63.25 180 top
C21  0.1uF  [C0805']  83.44,8.38 180 top
C22  0.1uF  [C0805']  24.13,58.17 90 top
C23  8pF  [C0805']  36.83,66.04 135 top
C24  0.1uF  [C0805']  22.23,52.07 0 top
C25  0.1uF  [C0805']  13.97,59.05 180 top
C26  0.1uF  [C0805']  12.06,51.44 90 top
EPS_SCL  80.64,22.86 0 top
EPS_SDA  74.93,25.4 0 top
EXT_UART  43.18,11.43 0 top
GND  93.98,31.11 90 top
GPS_PF  80.64,30.48 0 top
GPS_RX  80.64,33.02 0 top
GPS_TX  74.93,34.29 0 top
GPS_VPP  74.93,31.75 0 top
IMU_CLK  57.4,59.31 0 top
IMU_MISO  59.18,52.58 0 top
IMU_MOSI  58.93,58.55 0 top
J1  20.95,73.66 180 top
J2  52.07,73.66 180 top
JTAG  10.79,0 180 top
JTAG_PWR  29.84,23.5 180 top
JTAG_RX  10.16,20.95 0 top
JTAG_TX  10.16,18.41 0 top
LED1  11.43,31.75 90 top
LED2  15.24,31.75 90 top
LED3  19.05,31.75 90 top
LED4  22.86,31.75 90 top
LI_RST  73.41,50.16 0 top
LI_RX  79.63,43.18 0 top
LI_TX  76.83,41.91 0 top
MSP430  43.81,49.53 0 top
OA_RST  80.64,17.78 0 top
Q1  40.64,59.94 0 top
Q2  31.75,66.67 315 top
R1  78.11,70.99 180 top
R2  61.09,45.85 180 top
R3  58.42,38.73 90 top
R4  60.71,38.73 90 top
R5  51.82,35.94 180 top
R6  77.72,62.23 270 top
R7  80.01,62.23 270 top
R8  76.2,50.8 180 top
R9  34.29,74.3 180 top
R10  32.38,76.83 180 top
R11  55.88,66.04 270 top
R12  52.7,66.04 90 top
R13  19.68,18.41 270 top
R14  17.14,18.41 270 top
R15  30.73,46.99 180 top
R16  30.73,44.96 0 top
R17  73.79,43.18 180 top
R18  71.12,48.51 90 top
R19  46.1,34.29 0 top
R20  50.16,33.02 0 top
R21  11.43,27.3 90 top
R22  15.24,27.3 90 top
R23  19.05,27.3 90 top
R24  22.86,27.3 90 top
RBF  75.56,38.73 0 top
REF3330  20.95,58.17 90 top
SD_CONN  58.42,62.87 0 top
SD_DET  75.56,77.47 0 top
SW3  93.98,63.5 90 top
SW5  93.98,68.58 90 top
SW6  93.98,58.42 90 top
SW8  93.98,54.61 90 top
SW10  76.83,47.37 0 top
TCK  10.16,13.34 0 top
TDIO  10.16,15.88 0 top
TEMP1  30.48,54.61 0 top
TEMP2  22.23,48.26 0 top
TLV2452  16.51,52.7 270 top
TLV2461  21.59,63.88 180 top
TPS22942  57.78,43.18 0 top
U$1  0,0 0 top
U$2  60.83,56.9 0 top
U$3  78.11,58.42 90 top
U$4  [RBF_MOUNT]  88.9,0 90 top
VS-10BQ  82.55,5.08 0 top

### Tracks (layer width: path | path; a pad name or v marks a point on that pad's centre or on a via)
3V  (via drill 0.25)
  Top 0.203: 24.7,69.79 24.82,69.79 25.4,69.22 3V.TP
  Top 0.305: 20.95,64.52 22.23,63.25 TLV2461.2 | TLV2461.6 20.95,64.52 | 20.95,64.52 v20.95,66.42 | J1.4 20.2,68.95 v20.95,68.2 23.11,68.2 24.13,69.22 24.7,69.79 J1.1
  Bottom 0.305: v20.95,66.42 v20.95,68.2
3V3
  Top 0.203: 62.27,44.45 62.27,45.62 R2.1 | R8.1 79.46,50.8
  Top 0.406: TPS22942.5 61.29,43.83 C15.1 62.27,44.45 3V3.TP 79.63,44.45 | U$1.79 87,44.45 79.63,44.45 | 79.63,44.45 79.46,44.62 79.46,50.8 79.46,54.1 C14.1
  Top 0.508: U$3.1 79.45,54.36 C14.1
3V3_SD  (via drill 0.51)
  Top 0.203: U$3.5 76.52,57.47 74.93,59.05 74.93,62.93 76.77,64.77 77.47,64.77 77.79,65.09 C16.1 | C13.1 77.79,69.22 79.06,70.48 R1.1 v80.9,70.99 | 3V3_SD.TP 79.38,74.93 v80.9,73.41
  Top 0.762: C13.1 C16.1 77.16,66.67 68.96,66.67 66.62,64.33 SD_CONN.4
  Bottom 0.203: v80.9,73.41 v80.9,70.99
3V3_UC  (via drill 0.25)
  Top 0.203: C7.1 50.84,61.17 v52.3,62.63 52.55,62.89 54.5,62.89 55.88,64.27 R11.2 | 35.29,30.75 29.78,36.26 R16.1 R15.2 | R5.2 50.87,38.33 C10.1 | v50.8,64.14 50.86,64.14 51.82,65.09 R12.1 | 37.72,39.37 36.32,39.37 35.05,38.1 3V3_UC.TP | U$2.1 58.53,57.9 57.91,57.28 v57.91,56.39 57.91,54.06 C3.1 59.6,53.98 60.23,54.61 U$2.8 | v48.26,53.34 48.9,53.34
  Top 0.305: C6.1 MSP430.61 48.56,54.66 48.51,54.61 | 36.41,56.26 36.42,56.26 MSP430.80 39.06,54.66 39.12,54.61 | MSP430.40 49.53,42.8 51.02,41.32 C11.1 52.07,41.82 52.07,43.83 | C8.1 36.16,43.85 MSP430.20 38.94,44.78 38.99,44.83
  Top 0.406: TPS22942.1 52.07,43.83 49.52,43.83 48.9,44.45 48.9,53.34 48.9,54.61 48.51,54.61 39.12,54.61 38.99,54.61 38.99,44.83 38.99,44.32 37.72,43.05 37.72,39.37 37.72,33.17 35.29,30.75 JTAG_PWR.2
  Top 0.762: C7.1 C6.1 | C5.1 36.41,56.26 C1.1 | C10.1 C11.1 | C8.1 C9.1
  Bottom 0.203: v50.8,64.14 v52.3,62.63 | v57.91,56.39 51.31,56.39 v48.26,53.34
3V3BUS2  (via drill 0.25)
  Top 0.406: v93.98,43.18 3V3_ALT.TP
  Bottom 0.406: U$1.80 v93.98,43.18
3V_REF
  Top 0.203: 21.97,59.69 21.34,60.33 18.41,60.33 3VREF.TP
  Top 0.559: TLV2461.3 26.04,64.52 26.67,63.88 26.67,61.34 26.04,60.71 22.86,60.71 22.35,60.2 21.97,59.82 21.97,59.69 REF3330.2
5V_CHG
  Top 0.203: 87.06,13.97 93.6,13.97 5V_CHG.TP
  Top 0.305: U$1.32 87,36.83 87.06,36.77 87.06,13.97 87.06,11.05 C21.1 84.39,5.29 VS-10BQ.C
CLK_IMU
  Top 0.203: MSP430.55 53.05,51.78 54.61,53.34 54.61,57.15 56.77,59.31 IMU_CLK.TP 60.07,59.31 60.23,59.15 U$2.23
CLK_SD  (via drill 0.25)
  Top 0.203: MSP430.43 53.4,45.78 55.88,48.26 65.79,48.26 73.03,55.5 v73.03,59.69 | SD_CONN.5 67.72,61.82 69.85,59.69 v70.61,59.69
  Bottom 0.203: v73.03,59.69 v70.61,59.69
CS_IMU  (via drill 0.25)
  Top 0.203: U$2.22 60.63,59.92 56.74,59.92 54.1,57.28 54.1,54.7 v52.07,52.67 | v52.07,48.76 v52.07,47.5 | MSP430.15 38.14,47.28 v38.23,47.37
  Bottom 0.203: v52.07,52.67 v52.07,48.76 | v52.07,47.5 38.35,47.5 v38.23,47.37
CS_SD  (via drill 0.25)
  Top 0.203: v47.75,45.21 46.23,45.21 45.47,44.45 44.83,44.45 44.06,43.68 MSP430.31 | v54.23,45.21 57.28,45.21 59.05,46.99 66.55,46.99 v72.52,52.96 | v69.81,55.67 69.81,57.7 64.42,63.09 SD_CONN.2 64.42,63.78 72.26,71.63 76.52,71.63 R1.2
  Bottom 0.203: v47.75,45.21 50.67,45.21 v54.23,45.21 | v72.52,52.96 v69.81,55.67
EXT_RXD  (via drill 0.25)
  Top 0.203: v30.99,28.07 26.04,33.02 26.04,48.26 28.55,50.78 MSP430.8 | v40.89,18.16 45.72,13.34 EXT_UART.2
  Bottom 0.203: v30.99,28.07 v40.89,18.16
EXT_TXD  (via drill 0.25)
  Top 0.203: v32.26,29.34 27.18,34.42 27.18,48.13 28.83,49.78 35.69,49.78 36.18,50.28 MSP430.9 | v42.16,19.43 48.26,13.34 EXT_UART.3
  Bottom 0.203: v32.26,29.34 v42.16,19.43
GND  (via drill 0.25, 0.38, 0.55)
  Top 0.203: U$2.20 61.43,57.78 | 61.43,57.78 61.43,57.5 U$2.25 61.43,56.3 U$2.11 | U$2.18 61.54,57.9 61.43,57.78 | R24.1 v22.86,25.02 | R23.1 v19.05,25.02 | R22.1 v15.24,25.02 | R21.1 v11.43,25.02 | C23.2 v33.94,64.49 C19.2 | C5.2 34.71,56.9 | 34.71,56.9 C1.2 | C17.2 43.43,64.77 | 43.43,64.77 C18.2 | 43.43,64.77 v43.43,67.31 | 34.71,56.9 31.75,56.9 | 31.75,56.9 v31.11,56.9 | 41.02,55.24 39.75,55.24 39.56,55.43 MSP430.79 39.56,56.95 39.37,57.15 v38.1,57.15 | 41.02,55.24 42.34,55.24 42.56,55.47 MSP430.73 42.64,56.33 42.64,56.86 45.24,59.47 45.97,59.47 47.62,61.12 47.62,62.87 48.26,63.5 48.26,66.67 40.01,66.67 39.12,67.56 | 41.02,55.24 41.06,55.29 MSP430.76 41.06,58.72 40.16,59.63 40.16,61.69 39.12,62.74 39.12,67.56 | 39.12,67.56 37.47,69.22 33.02,69.22 29.21,65.41 29.21,60.96 31.75,58.42 31.75,56.9 | 31.75,56.9 31.75,54.61 36.39,54.61 36.49,54.71 38.1,54.71 v38.1,55.24
  Top 0.762: C9.2 C8.2 | C13.2 C16.2 | C11.2 C10.2 | C7.2 C6.2
  Bottom 0.203: v33.94,64.49 30.48,67.94 | 30.48,67.94 | v38.1,57.15 v38.1,55.24
  other vias: 43.18,13.08 41.4,11.43 43.18,9.78 19.43,11.05 22.1,11.05 20.83,13.97 43.69,36.58 45.09,38.1 56.9,37.85 58.42,36.32 59.82,41.78 62.99,41.91 76.45,54.23 77.98,55.75 77.85,52.7 80.77,58.42 81.15,68.33 81.15,66.04 71.75,65.15 69.09,64.9 69.47,61.34 65.91,57.78 66.29,54.86 62.74,59.44 63.12,54.23 56.9,55.63 52.07,54.48 54.1,58.8 23.24,53.59 24.64,52.07 23.24,50.55 13.46,55.12 14.61,57.02 14.61,53.34 14.22,61.72 14.22,64.77 12.83,63.25 25.91,65.79 22.23,65.79 33.27,78.36 34.8,76.83 36.7,74.3 35.18,72.77 48.64,70.61 49.78,69.34 59.94,51.82 78.61,64.52 74.42,65.15 76.07,62.74 25.78,59.18 18.67,58.17 20.07,57.02 22.61,58.17 20.07,59.31 32.89,43.18 81.03,8.38 82.55,6.86 44.58,28.96 47.88,38.73 49.28,37.08 73.53,69.85 70.99,58.67 46.61,53.09 40.89,45.47 49.66,63.12 56.26,57.53 53.21,48.39 73.03,61.09 44.7,45.47 40.89,49.28 45.72,49.28 40.89,53.09 57.02,46.48 32.89,40.89 34.42,39.37 11.56,59.05 12.06,53.85 93.98,29.84 60.83,56.9 66.42,45.72 51.44,25.4 33.66,47.12 49.02,65.02 35.56,53.85
  pour Bottom: 0,90.17 0,0 95.89,0 95.89,90.17
  pour Top (rank 6): 0,0 0,90.17 95.89,90.17 95.89,0
GPS_PF  (via drill 0.25)
  Top 0.203: U$1.24 87,46.99 88.9,46.99 89.53,46.35 v89.53,29.21 | v84.45,29.21 81.92,29.21 GPS_PF.TP 71.12,30.48 70.61,30.99 57.53,30.99 57.02,30.48 v56.26,30.48 | MSP430.33 45.06,41.88 38.99,35.81 38.99,32.89 41.4,30.48 v41.91,30.48
  Bottom 0.203: v89.53,29.21 v84.45,29.21 | v56.26,30.48 v41.91,30.48
GPS_VPP  (via drill 0.25)
  Top 0.203: U$1.23 84.31,47.14 v84.45,47.14 | v84.45,41.89 84.45,32.38 83.82,31.75 GPS_VPP.TP v56.26,31.75 | MSP430.34 45.56,41.76 39.88,36.07 39.88,33.4 41.53,31.75 v41.91,31.75
  Bottom 0.203: v84.45,47.14 v84.45,41.89 | v56.26,31.75 v41.91,31.75
HFXIN
  Top 0.203: MSP430.74 42.06,57.43 45.03,60.39 Q1.2 45.55,60.39 46.48,61.33 46.48,64.58 C18.1
HFXOUT
  Top 0.203: MSP430.75 41.56,58.2 42.8,59.44 42.8,61.13 Q1.1 40.73,63.2 40.73,64.36 C17.1
INT_IMU  (via drill 0.25)
  Top 0.203: MSP430.44 52.88,46.28 v54.86,48.26 | U$2.12 63.55,55.2 64.52,54.23 64.52,51.69 63.75,50.93 v54.86,50.93
  Bottom 0.203: v54.86,48.26 54.86,50.42 v54.86,50.93
JTAG_RXD  (via drill 0.25)
  Top 0.203: MSP430.41 52.5,44.78 v52.7,44.58 | v53.09,42.67 54.23,41.53 54.23,29.21 53.59,28.57 48.51,28.57 v37.59,17.65 | v26.06,17.78 24.48,19.36 R13.1 19.68,19.68 18.41,20.95 JTAG_RX.TP
  Bottom 0.203: v53.09,42.67 53.09,44.2 v52.7,44.58 | v37.59,17.65 26.19,17.65 v26.06,17.78
JTAG_TXD  (via drill 0.25)
  Top 0.178: 15.24,18.41 JTAG_TX.TP
  Top 0.203: MSP430.42 53.02,45.28 53.72,44.58 v55.24,44.58 | v15.24,15.88 15.24,18.41 16.19,19.36 R14.1 | v55.24,42.67 55.24,29.08 53.72,27.56 48.9,27.56 37.21,15.88 v35.69,15.88
  Bottom 0.203: v55.24,44.58 v55.24,42.67 | v35.69,15.88 v15.24,15.88
LFXIN
  Top 0.203: MSP430.77 40.56,57.99 39.75,58.8 39.75,60.51 Q2.1 37.97,64.9 C23.1
LFXOUT
  Top 0.203: MSP430.78 40.06,57.34 37.72,59.69 36.9,59.69 Q2.2 33.53,60.45 C19.1
LI_OA_RESET  (via drill 0.25)
  Top 0.203: v92.71,16.51 92.71,63.5 91.44,64.77 81.6,64.77 R7.1 | v63.5,35.31 61.02,37.78 R4.1 | U$1.47 OA_RST.TP 74.93,17.78 63.5,29.21 v63.5,29.46
  Bottom 0.203: U$1.47 84.45,16.51 v92.71,16.51 | v63.5,29.46 v63.5,35.31
LITHIUM_RST  (via drill 0.25)
  Top 0.203: v69.22,54.86 69.15,54.92 69.15,57.6 65.03,61.72 53.21,61.72 v53.21,61.85 | v78.36,49.15 74.42,49.15 LI_RST.TP 72.39,51.18 v72.39,51.44 | v81.66,49.15 81.66,45.85 v81.53,45.72 | v81.53,43.43 81.79,43.18 U$1.27 | v50.55,61.85 50.3,61.85 45.56,57.12 MSP430.67
  Bottom 0.203: v50.55,61.85 v53.21,61.85 | v78.36,49.15 v81.66,49.15 | v81.53,45.72 v81.53,43.43 | v72.39,51.44 72.26,51.44 69.22,54.48 v69.22,54.86
LITHIUM_RX  (via drill 0.25)
  Top 0.203: MSP430.65 46.56,56.86 47.05,57.34 47.69,57.34 v50.16,59.82 | v66.8,52.96 66.8,54.23 67.82,55.24 67.82,57.15 64.57,60.4 55.49,60.4 54.9,59.82 v51.47,59.82 | R17.2 v70.1,43.18
  Bottom 0.203: v50.16,59.82 v51.47,59.82 | v66.8,52.96 70.1,49.66 v70.1,43.18
LITHIUM_TX  (via drill 0.25)
  Top 0.203: MSP430.66 46.06,56.99 47.24,58.17 49.78,60.71 v50.2,60.71 | v67.99,53.93 68.58,54.53 68.58,57.53 64.9,61.21 52.87,61.21 v52.49,60.83 | R18.2 v71.12,50.67
  Bottom 0.203: v52.49,60.83 50.33,60.83 v50.2,60.71 | v71.12,50.67 67.99,53.81 v67.99,53.93
MISO_IMU  (via drill 0.25)
  Top 0.203: MSP430.54 53.44,51.28 v54.61,52.45 | v55.88,52.45 59.05,52.45 IMU_MISO.TP 59.18,52.83 60.63,54.28 U$2.9
  Bottom 0.203: v54.61,52.45 v55.88,52.45
MISO_SD
  Top 0.203: MSP430.52 66.66,50.28 71.83,55.44 71.83,60.27 69.92,62.17 SD_CONN.7
MOSI_IMU
  Top 0.203: MSP430.53 53.83,50.78 55.24,52.2 55.24,55.24 58.55,58.55 IMU_MOSI.TP 58.98,58.6 U$2.24
MOSI_SD  (via drill 0.25)
  Top 0.203: MSP430.51 52.7,49.78 53.21,49.26 v65.02,49.26 | SD_CONN.3 65.52,62.75 70.48,57.78 70.48,55.24 66.42,51.18 v65.02,51.18
  Bottom 0.203: v65.02,49.26 65.02,50.55 v65.02,51.18
N$1
  Top 0.203: TPS22942.3 57.66,42.53 57.66,44 59.5,45.85 R2.2
N$2
  Top 0.203: R6.2 R7.2
  Top 0.381: U$3.3 79.38,59.37 77.72,61.03 R6.2
N$3
  Top 0.203: U$2.10 61.03,53.05 C4.1
N$4
  Top 0.203: LED1.C R21.2
N$5
  Top 0.203: TPS22942.4 58.73,40 R3.2 R4.2
N$6  (via drill 0.25)
  Top 0.203: MSP430.27 42.06,42.19 40.51,40.64 40.26,40.64 v38.99,39.37 | v11.43,34.29 LED1.A
  Bottom 0.203: v38.99,39.37 37.72,38.1 11.43,38.1 v11.43,34.29
N$7
  Top 0.203: R8.2 75.25,55.56 76.07,56.39 77.47,56.39 78.11,57.02 78.11,58.91 77.64,59.37 U$3.4
N$8
  Top 0.203: R14.2 17.14,15.88 14.61,13.34 14.61,10.91 JTAG.14
N$9  (via drill 0.25)
  Top 0.203: MSP430.28 42.56,42 v39.9,39.37 | v15.24,34.29 LED2.A
  Bottom 0.203: v39.9,39.37 37.39,36.83 15.24,36.83 v15.24,34.29
N$10
  Top 0.203: LED2.C R22.2
N$11
  Top 0.203: JTAG.12 17.02,11.04 17.02,13.21 19.68,15.88 R13.2
N$12  (via drill 0.25)
  Top 0.203: MSP430.29 43.06,41.66 v40.82,39.37 | v19.05,34.29 LED3.A
  Bottom 0.203: v40.82,39.37 36.97,35.56 19.05,35.56 v19.05,34.29
N$13
  cutout Bottom: 30.48,66.67 33.02,69.22 37.47,69.22 40.01,66.67 48.26,66.67 48.26,62.87 48.26,60.96 45.59,58.29 44.96,58.29 42.67,56.01 42.67,54.86 42.42,54.61 31.75,54.61 31.75,58.42 29.21,60.96 29.21,65.41
  cutout Top: 30.48,66.67 33.02,69.22 37.47,69.22 40.01,66.67 48.26,66.67 48.26,62.87 48.26,60.96 45.59,58.29 44.96,58.29 42.67,56.01 42.67,54.86 42.42,54.61 31.75,54.61 31.75,58.42 29.21,60.96 29.21,65.41
N$14
  Top 0.305: 5V_DC.1 61.47,11.56 67.94,5.08 VS-10BQ.A
N$15
  Top 0.203: LED3.C R23.2
N$16  (via drill 0.25)
  Top 0.203: MSP430.30 43.56,41.28 v41.66,39.37 | v22.86,34.29 LED4.A
  Bottom 0.203: v41.66,39.37 36.58,34.29 v22.86,34.29
N$17
  Top 0.203: LED4.C R24.2
N$96  (via drill 0.25)
  Top 0.203: U$1.35 GPS_RX.TP v56.26,33.02 | v52.45,33.02 R20.2
  Bottom 0.203: v56.26,33.02 v52.45,33.02
N$97  (via drill 0.25)
  Top 0.203: U$1.33 81.92,34.29 GPS_TX.TP v56.26,34.29 | R19.2 v48.26,34.29
  Bottom 0.203: v48.26,34.29 v56.26,34.29
N$98  (via drill 0.25)
  Top 0.203: U$1.31 79.38,41.91 LI_TX.TP 71.37,41.91 v71.12,42.16 | v71.12,46.35 R18.1
  Bottom 0.203: v71.12,42.16 v71.12,46.35
N$99
  Top 0.203: U$1.29 82.55,40.64 80.01,43.18 LI_RX.TP R17.1
PINAVL1_RX  (via drill 0.25)
  Top 0.203: MSP430.35 46.06,41.62 40.89,36.45 40.89,33.78 41.66,33.02 v41.91,33.02 | R20.1 v43.94,33.02
  Bottom 0.203: v43.94,33.02 v41.91,33.02
PINAVL1_TX  (via drill 0.25)
  Top 0.203: MSP430.36 46.56,41.48 41.91,36.83 v41.91,34.29 | R19.1 v43.94,34.29
  Bottom 0.203: v43.94,34.29 v41.91,34.29
RBF_C  (via drill 0.51)
  Top 0.203: v65.41,39.37 66.67,38.1 68.58,38.1 70.11,39.63 RBF.P$1
RBF_NC  (via drill 0.51)
  Top 0.203: v78.74,40.01 77.19,40.01 RBF.P$3
RBF_NO  (via drill 0.51)
  Top 0.203: RBF.P$2 75.56,41.15 69.72,41.15 v67.94,39.37
SBWTCK  (via drill 0.25)
  Top 0.203: MSP430.37 47.06,41.35 42.93,37.21 42.93,25.78 v31.11,13.97 | v26.04,13.97 24.96,13.97 JTAG.7 24.64,11.04 24.64,8.76 24.13,8.26 12.7,8.26 10.16,10.79 TCK.TP
  Bottom 0.203: v26.04,13.97 v31.11,13.97
SBWTDIO
  Top 0.203: 53.34,34.54 49.91,34.54 47.88,36.58 C12.1 46.99,36.64 46.99,39.37 47.56,39.95 MSP430.38 | 53.34,34.54 53.34,29.65 48.06,29.65 30.95,12.54 JTAG.1 32.38,10.91 32.38,8.89 30.99,7.49 11.56,7.49 8.89,10.16 8.89,14.61 TDIO.TP | R5.1 53.34,35.37 53.34,34.54
SCL_ANT
  Top 0.203: MSP430.70 44.06,57.02 48.13,61.09 48.13,62.74 52.38,66.99 R12.2 52.82,67.11 J2.2 52.82,71 51.94,71.88 43.94,71.88 ANT_SCL.TP
SCL_EPS  (via drill 0.25)
  Top 0.203: MSP430.14 36.2,47.78 33.38,44.96 R16.2 31.68,39.37 31.68,36.77 | 31.68,36.77 | v68.83,25.53 71.5,22.86 EPS_SCL.TP U$1.43 | v67.18,23.88 v46.61,23.88 | 31.68,36.77 v35.69,32.77
  Bottom 0.203: v68.83,25.53 v67.18,23.88 | v46.61,23.88 43.18,27.3 42.55,27.3 37.08,32.77 v35.69,32.77
SD_DETECT  (via drill 0.25)
  Top 0.203: v47.75,46.48 43.48,46.48 41.06,44.06 MSP430.25 | v75.56,67.97 v75.56,70.61 | v55.37,46.35 56.77,47.75 65.91,47.75 74.17,56.01 74.17,63.37 75.56,64.77 v75.56,65.41 | SD_DET.TP 74.68,78.36 72.64,78.36 71.75,77.47 71.75,74.31 SD_CONN.DET 73.89,74.31 74.8,73.41 v75.56,73.41
  Bottom 0.203: v75.56,65.41 v75.56,67.97 | v75.56,70.61 v75.56,73.41 | v47.75,46.48 55.24,46.48 v55.37,46.35
SDA_ANT  (via drill 0.25)
  Top 0.203: MSP430.69 44.56,56.89 51.18,63.5 53.72,63.5 54.23,64.01 54.23,66.04 55.18,66.99 R11.1 55.88,67.24 54.54,68.58 v53.85,68.58 | J2.3 51.32,68.56 v51.3,68.58 48.9,68.58 47.62,69.85 ANT_SDA.TP
  Bottom 0.203: v53.85,68.58 v51.3,68.58
SDA_EPS  (via drill 0.25)
  Top 0.203: MSP430.13 31.75,48.28 | 31.75,48.28 31.73,48.28 31.11,48.9 29.21,48.9 28.19,47.88 28.19,35.94 v33.53,30.61 | 31.75,48.28 31.75,47.06 R15.1 | v45.34,22.61 68.07,22.61 v68.33,22.86 | U$1.41 EPS_SDA.TP 70.87,25.4 v70.61,25.15
  Bottom 0.203: v70.61,25.15 v68.33,22.86 | v33.53,30.61 35.18,28.96 38.99,28.96 v45.34,22.61
SHIELD  (3 unrouted)
SW3  (via drill 0.25)
  Top 0.203: U$1.63 89.53,62.23 v91.95,62.23 | v93.98,62.23 SW3.TP
  Bottom 0.203: v91.95,62.23 v93.98,62.23
SW5  (via drill 0.25)
  Top 0.203: J2.1 55.59,70.62 57.36,72.39 83.82,72.39 84.45,71.75 84.45,67.94 85.09,67.31 v89.53,67.31 92.71,67.31 SW5.TP
  Bottom 0.203: v89.53,67.31 89.53,62.23 U$1.65
SW6  (via drill 0.25)
  Top 0.203: v93.98,57.15 SW6.TP
  Bottom 0.203: U$1.67 89.53,57.15 v93.98,57.15
SW8  (via drill 0.25)
  Top 0.203: v93.98,55.88 SW8.TP
  Bottom 0.203: U$1.70 v93.98,55.88
SW10  (via drill 0.25)
  Top 0.203: U$2.13 64.19,55.9 C2.1 | U$1.72 89.53,52.07 82.55,52.07 80.64,50.16 v80.64,47.37 | C2.1 64.56,55.33 65.79,54.1 v65.79,51.82 | v56.77,70.23 58.29,68.71 v58.29,62.48 58.42,62.36 v61.98,62.36 | C20.1 16.19,65.21 18.29,67.31 26.67,67.31 27.3,67.94 27.94,67.94 | 27.94,67.94 29.21,67.94 33.15,71.88 41.4,71.88 42.55,73.03 53.98,73.03 v55.24,71.75 | C24.1 21.27,53.02 22.61,54.36 v26.04,54.36 | C22.1 24.2,57.15 26.04,57.15 | 26.04,57.15 27.94,59.05 27.94,67.94 | 26.04,57.15 v26.04,56.52 | v78.36,47.37 SW10.TP 76.58,47.37 74.93,45.72 74.8,45.59 v68.83,45.59 | C2.1 64.56,58.63 v64.14,59.05
  Top 0.559: C20.1 TLV2461.7 | REF3330.1 C22.1
  Top 0.61: C24.1 20.24,52.07 TLV2452.8
  Bottom 0.203: v80.64,47.37 v78.36,47.37 | v68.83,45.59 65.79,48.64 v65.79,51.82 | v56.77,70.23 v55.24,71.75 | v26.04,56.52 v26.04,54.36 | v64.14,59.05 64.14,62.36 v61.98,62.36
TMP1  (via drill 0.25)
  Top 0.203: 11.81,62.8 11.81,62.87
  Top 0.305: v21.59,69.22 22.43,69.22 23.2,69.98 J1.2 | v19.05,69.22 18.16,68.33 14.35,68.33 11.81,65.79 11.81,62.87 | TLV2452.3 15.88,58.1 C25.1 14.92,59.69 11.81,62.8
  Bottom 0.305: v21.59,69.22 v19.05,69.22
TMP1_OUT
  Top 0.305: TLV2452.2 TLV2452.1 18.7,55.45 29.64,55.45 | MSP430.5 32.81,52.28 TEMP1.TP 29.64,55.45 | 29.64,55.45
TMP1_RET
  Top 0.305: R9.2 31.75,74.3 29.84,72.39 22.84,72.39 21.7,71.25 J1.3
TMP2
  Top 0.305: J1.5 18.7,70.37 17.55,69.22 13.97,69.22 10.16,65.41 10.16,51.76 11.43,50.48 C26.1 12.31,50.24 TLV2452.5
TMP2_OUT
  Top 0.305: MSP430.6 27.02,51.78 23.5,48.26 TEMP2.TP 17.14,48.26 TLV2452.7 TLV2452.6
TMP2_RET
  Top 0.305: R10.2 31.11,76.83 27.94,73.66 18.98,73.66 17.2,71.89 J1.6
VCC_TARGET
  Top 0.381: JTAG_PWR.3 27.18,21.57
  Top 0.406: JTAG.4 27.18,11.04 27.18,21.57
VCC_TOOL
  Top 0.406: JTAG.2 29.72,11.04 29.72,14.48 32.38,17.14 JTAG_PWR.1

### Text on the board
tPlace: NC | C | NO | Target | Tool | Tx | Rx
Document: VT VCC Mainboard / Rev C - 10/16/18
Reference: AGND | GND | 16 MHz | 32768 Hz | Via to / GND